# EAGLE schematic PLACA3P (EAGLE 9.5.1)
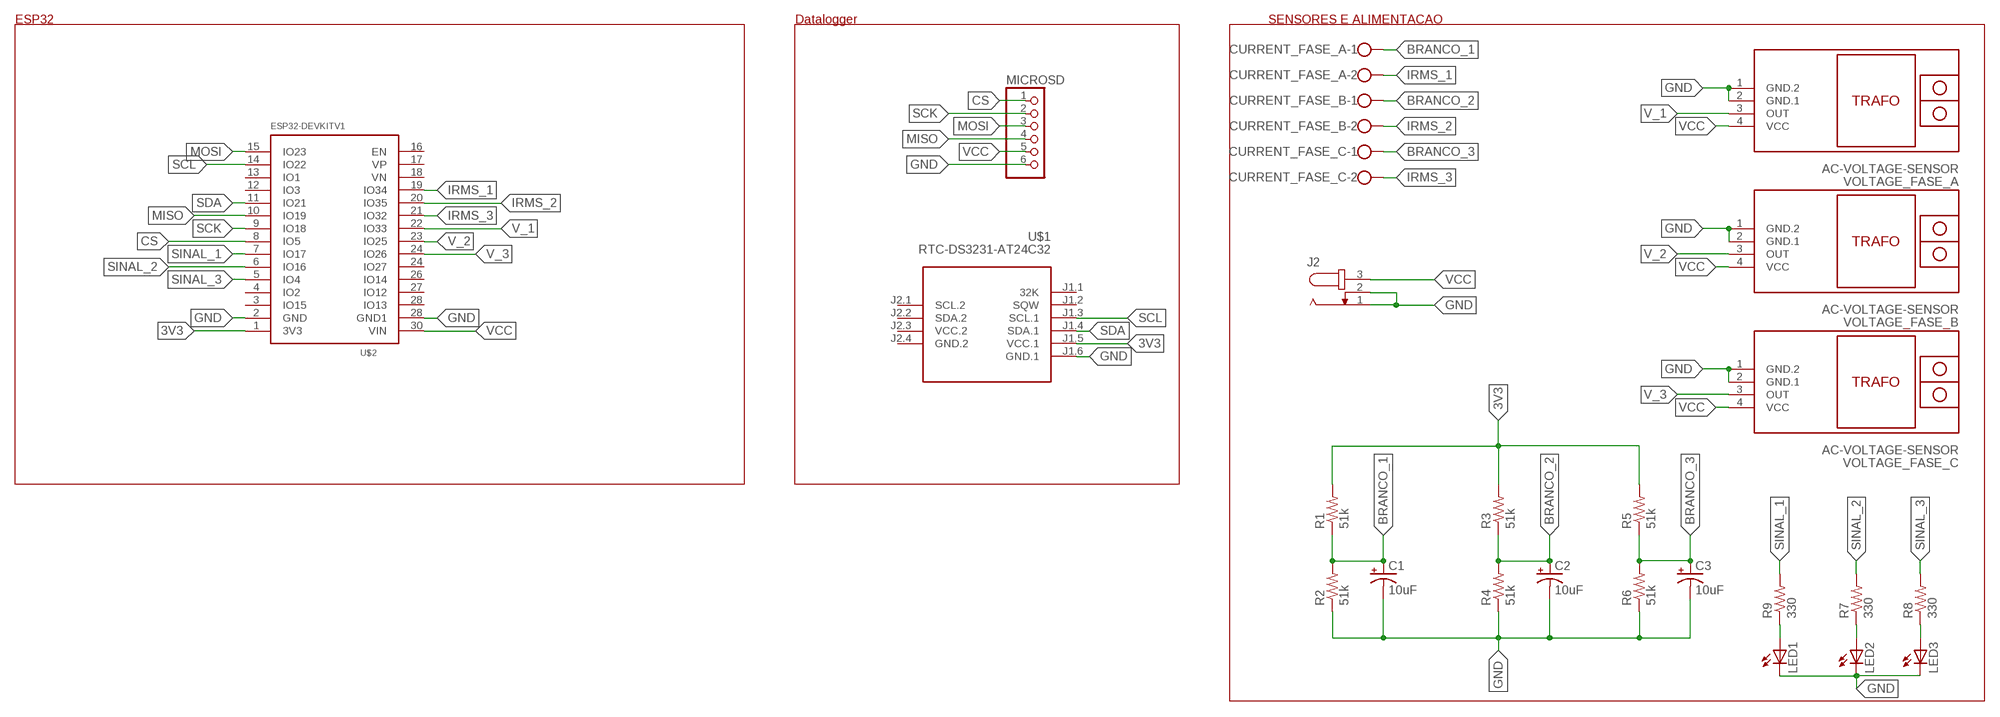
[diagram p0: schematic, sheet 1]

## Parts
C1  10uF  CPOL-USE2-4  [E2-4]
C2  10uF  CPOL-USE2-4  [E2-4]
C3  10uF  CPOL-USE2-4  [E2-4]
CURRENT_FASE_A  W237-102  [W237-102]
CURRENT_FASE_B  W237-102  [W237-102]
CURRENT_FASE_C  W237-102  [W237-102]
J2  JACK-PLUG1  [SPC4078]
LED1  LED5MM  [LED5MM]
LED2  LED5MM  [LED5MM]
LED3  LED5MM  [LED5MM]
MICROSD  PINHD-1X6B  [1X06-BIG]
R1  51k  R-US_0207/12  [0207/12]
R2  51k  R-US_0207/12  [0207/12]
R3  51k  R-US_0207/12  [0207/12]
R4  51k  R-US_0207/12  [0207/12]
R5  51k  R-US_0207/12  [0207/12]
R6  51k  R-US_0207/12  [0207/12]
R7  330  R-US_0207/12  [0207/12]
R8  330  R-US_0207/12  [0207/12]
R9  330  R-US_0207/12  [0207/12]
U$1  RTC-DS3231-AT24C32  [RTC-DS3231-AT24C32]
U$2  ESP32DEVKITV1  [ESP32-DEVKITV1]
VOLTAGE_FASE_A  AC-VOLTAGE-SENSOR  [AC-VOLTAGE-SENSOR]
VOLTAGE_FASE_B  AC-VOLTAGE-SENSOR  [AC-VOLTAGE-SENSOR]
VOLTAGE_FASE_C  AC-VOLTAGE-SENSOR  [AC-VOLTAGE-SENSOR]

## Nets
3V3: R1.2 R3.2 R5.2 U$1.J1.5(VCC.1) U$2.1(3V3)
BRANCO_1: C1.+ CURRENT_FASE_A.1 R1.1 R2.2
BRANCO_2: C2.+ CURRENT_FASE_B.1 R3.1 R4.2
BRANCO_3: C3.+ CURRENT_FASE_C.1 R5.1 R6.2
CS: MICROSD.1 U$2.8(IO5)
GND: C1.- C2.- C3.- J2.1 J2.2 LED1.K(C) LED2.K(C) LED3.K(C) MICROSD.6 R2.1 R4.1 R6.1 U$1.J1.6(GND.1) U$2.2(GND) U$2.28(GND1) VOLTAGE_FASE_A.1(GND.2) VOLTAGE_FASE_A.2(GND.1) VOLTAGE_FASE_B.1(GND.2) VOLTAGE_FASE_B.2(GND.1) VOLTAGE_FASE_C.1(GND.2) VOLTAGE_FASE_C.2(GND.1)
IRMS_1: CURRENT_FASE_A.2 U$2.19(IO34)
IRMS_2: CURRENT_FASE_B.2 U$2.20(IO35)
IRMS_3: CURRENT_FASE_C.2 U$2.21(IO32)
MISO: MICROSD.4 U$2.10(IO19)
MOSI: MICROSD.3 U$2.15(IO23)
N$1: LED1.A R9.1
N$2: LED2.A R7.1
N$3: LED3.A R8.1
SCK: MICROSD.2 U$2.9(IO18)
SCL: U$1.J1.3(SCL.1) U$2.14(IO22)
SDA: U$1.J1.4(SDA.1) U$2.11(IO21)
SINAL_1: R9.2 U$2.7(IO17)
SINAL_2: R7.2 U$2.6(IO16)
SINAL_3: R8.2 U$2.5(IO4)
V_1: U$2.22(IO33) VOLTAGE_FASE_A.3(OUT)
V_2: U$2.23(IO25) VOLTAGE_FASE_B.3(OUT)
V_3: U$2.24(IO26) VOLTAGE_FASE_C.3(OUT)
VCC: J2.3 MICROSD.5 U$2.30(VIN) VOLTAGE_FASE_A.4(VCC) VOLTAGE_FASE_B.4(VCC) VOLTAGE_FASE_C.4(VCC)
Unconnected: U$1.J1.1(32K) U$1.J1.2(SQW) U$1.J2.1(SCL.2) U$1.J2.2(SDA.2) U$2.3(IO15) U$2.4(IO2) U$2.12(IO3) U$2.13(IO1) U$2.16(EN) U$2.17(VP) U$2.18(VN) U$2.24(IO27) U$2.26(IO14) U$2.27(IO12) U$2.28(IO13)

## Notes on the sheet
- ESP32 | Datalogger | SENSORES E ALIMENTACAO

## Power pins joined to a net without a drawn wire
GND.2: U$1.J2.4(GND.2)
VCC.2: U$1.J2.3(VCC.2)

## Library data of the parts
C1-C3 = rcl:CPOL-US: POLARIZED CAPACITOR, American symbol; SPICEPREFIX: C
CURRENT_FASE_A CURRENT_FASE_B CURRENT_FASE_C = con-wago-500:W237-102: WAGO SCREW CLAMP; MPN: 237-102; OC_FARNELL: unknown; OC_NEWARK: 70K9898
J2 = con-jack:JACK-PLUG: DC POWER JACK Power Jack, DC, Right Angle, Through Hole, Rated 5A at 16VDC, PC Terminals Distributor: Farnell (www.Farnell.de) Drawing: 84N1161.pdf / 84N1162.pdf Manufacturer: SPC Technology (www.spctechnology.com) Type: SPC4077 / SPC 4078; OC_FARNELL: unknown; OC_NEWARK: unknown
LED1-LED3 = adafruit:LED: LED OSRAM: - CHIPLED LG R971, LG N971, LY N971, LG Q971, LY Q971, LO R971, LY R971 LH N974, LH R974 LS Q976, LO Q976, LY Q976 LO Q996 - Hyper CHIPLED LW Q18S LB Q993, LB Q99A, LB R99A - SideLED LS A670, LO A670, LY A670, LG A670, LP A670 LB A673, LV A673, LT A673, LW A673 LH A674 LY A675 LS A676, LA A676, LO A676, LY A676, LW A676 LS A679, LY A679, LG A679 - Hyper Micro SIDELED® LS Y876, LA Y876, LO Y876, LY Y876 LT Y87S - SmartLED LW L88C, LW L88S LB L89C, LB L89S, LG L890 LS L89K, LO L89K, LY L89K LS L896, LA L896, LO L896, LY L896 - TOPLED LS T670, LO T670, LY T670, LG T670, LP T670 LSG T670, LSP T670, LSY T670, LOP T670, LYG T670 LG T671, LOG T671, LSG T671 LB T673, LV T673, LT T673, LW T673 LH T674 LS T676, LA T676, LO T676, LY T676, LB T676, LH T676, LSB T676, LW T676 LB T67C, LV T67C, LT T67C, LS T67K, LO T67K, LY T67K, LW E67C LS E67B, LA E67B, LO E67B, LY E67B, LB E67C, LV E67C, LT E67C LW T67C LS T679, LY T679, LG T679 LS T770, LO T770, LY T770, LG T770, LP T770 LB T773, LV T773, LT T773, LW T773 LH T774 LS E675, LA E675, LY E675, LS T675 LS T776, LA T776, LO T776, LY T776, LB T776 LHGB T686 LT T68C, LB T68C - Hyper Mini TOPLED® LB M676 - Mini TOPLED Santana® LG M470 LS M47K, LO M47K, LY M47K Source: http://www.osram.convergy.de/
MICROSD = adafruit2:PINHD-1X6: PIN HEADER
R1-R9 = adafruit:R-US_: RESISTOR, American symbol
U$1 = diy-modules:RTC-DS3231-AT24C32: RTC Module with Battery and EEPROM based on DS3231 and AT24C32 chips Tutorial can be found here: https://edwardmallon.wordpress.com/2014/05/21/using-a-cheap-3-ds3231-rtc-at24c32-eeprom-from-ebay/ Click here to find device on ebay.com <http://www.ebay.com/sch/DS3231+AT24C32+module>
U$2 = ESP32-DEVKITV1:ESP32DEVKITV1
VOLTAGE_FASE_A VOLTAGE_FASE_B VOLTAGE_FASE_C = diy-modules:AC-VOLTAGE-SENSOR: Isolated AC Voltage Sensor based on ZMPT101B transformer ZMPT101B Voltage Transformer Operating Guide is available here: http://www.zeming-e.com/file/0_2013_10_18_093344.pdf Click here to find device on ebay.com <http://www.ebay.com/sch/arduino+voltage+transformer>